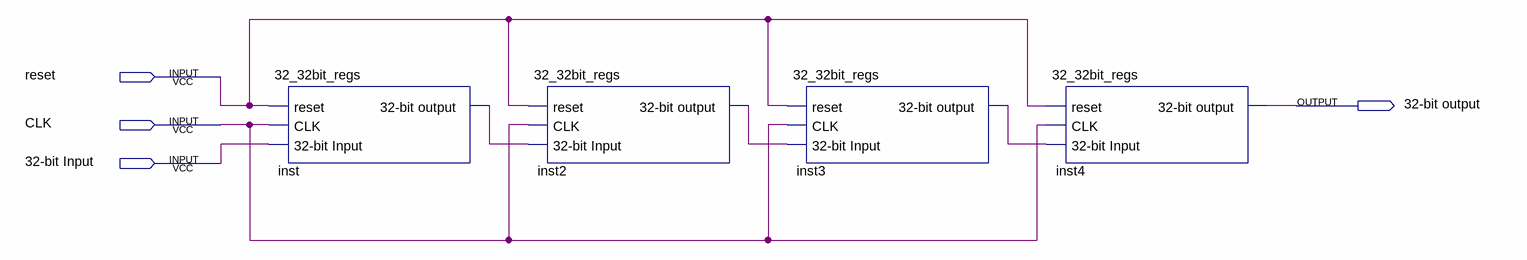
[diagram p0: schematic sheet]
// Quartus schematic 128_32bit_regs.bdf as structural Verilog: 4 symbols, 4 pins
module \128_32bit_regs  (
  input  reset,
  input  CLK,
  input  \32-bit_Input ,
  output \32-bit_output 
);

  wire inst2_32_bit_output, inst3_32_bit_output, inst_32_bit_output;

  \32_32bit_regs  inst (
    .reset(reset), .CLK(CLK), .\32-bit_Input (\32-bit_Input ), .\32-bit_output (inst_32_bit_output));
  \32_32bit_regs  inst2 (
    .reset(reset), .CLK(CLK), .\32-bit_Input (inst_32_bit_output), .\32-bit_output (inst2_32_bit_output));
  \32_32bit_regs  inst3 (
    .reset(reset), .CLK(CLK), .\32-bit_Input (inst2_32_bit_output), .\32-bit_output (inst3_32_bit_output));
  \32_32bit_regs  inst4 (
    .reset(reset), .CLK(CLK), .\32-bit_Input (inst3_32_bit_output), .\32-bit_output (\32-bit_output ));
endmodule
